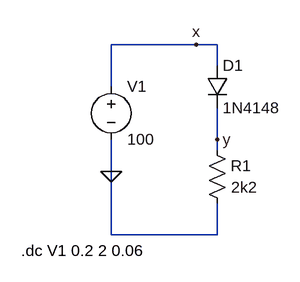
[diagram p0: schematic Tema1_Ionescu_Cristina_323CC.asc]
Tema1_Ionescu_Cristina_323CC.asc, the LTspice schematic file:
Version 4
SHEET 1 880 680
WIRE 192 0 64 0
WIRE 224 0 192 0
WIRE 224 32 224 0
WIRE 64 64 64 0
WIRE 224 144 224 96
WIRE 224 160 224 144
WIRE 64 192 64 144
WIRE 64 288 64 192
WIRE 224 288 224 240
WIRE 224 288 64 288
FLAG 224 144 y
FLAG 192 0 x
FLAG 64 192 0
SYMBOL diode 208 32 R0
SYMATTR InstName D1
SYMATTR Value 1N4148
SYMBOL res 208 144 R0
WINDOW 3 37 72 Left 2
SYMATTR Value 2k2
SYMATTR InstName R1
SYMBOL voltage 64 48 R0
WINDOW 123 0 0 Left 0
WINDOW 39 24 124 Left 2
SYMATTR InstName V1
SYMATTR Value 100
TEXT -72 312 Left 2 !.dc V1 0.2 2 0.06

The netlist it stands for:
* Tema1_Ionescu_Cristina_323CC.asc
D1 x y 1N4148
R1 y 0 2k2
V1 x 0 100
.model D D
.lib standard.dio
.dc V1 0.2 2 0.06
.backanno
.end

* Results of the author's LTspice run, read from the files saved beside the schematic
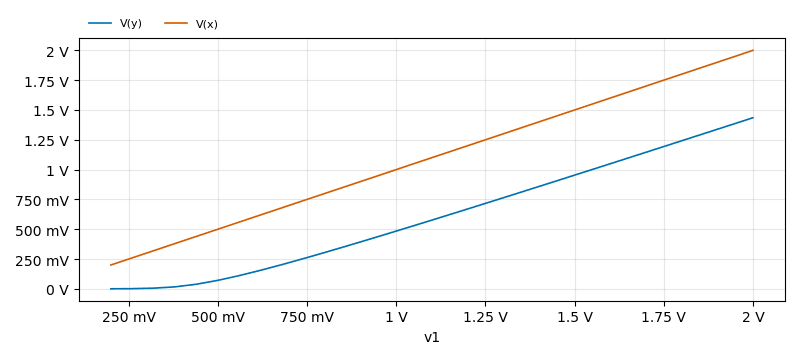
[diagram p1: DC transfer characteristic of Tema1_Ionescu_Cristina_323CC.asc, plotted from the saved traces]
* DC transfer characteristic, 1 run:
*   V(y): 447.7 µV at v1=200 mV, 1.435 V at v1=2 V, min 447.7 µV, max 1.435 V
*   V(x): 200 mV at v1=200 mV, 2 V at v1=2 V, min 200 mV, max 2 V